# Altium schematic sheet SC945D_Interface_BP_et_Prog.SchDoc: Interface Boitier Principal & Programmation
size 393 x 270 mm; CompanyName: Seccom; Address1: 521, rue du capt. François Garbit; Address2: 69440 Mornant; Address3: seccom@seccom.fr; Address4: www.seccom.fr; DocumentNumber: 2; SheetNumber: 2; SheetTotal: 9; PageSetup: Record=PageOptions|CenterHorizontal=True|CenterVertical=True|PrintScale=0.74|XCorrection=1.00|YCorrection=1.00|PrintKind=0|BorderSize=5000000|LeftOffset=0|BottomOffset=0|Orientation=2|PaperLength=1000|PaperWidth=1000|Scale=100|PaperSource=7|PrintQuality=-4|MediaType=1|DitherType=10|PaperKind=A4|PrintScaleMode=1
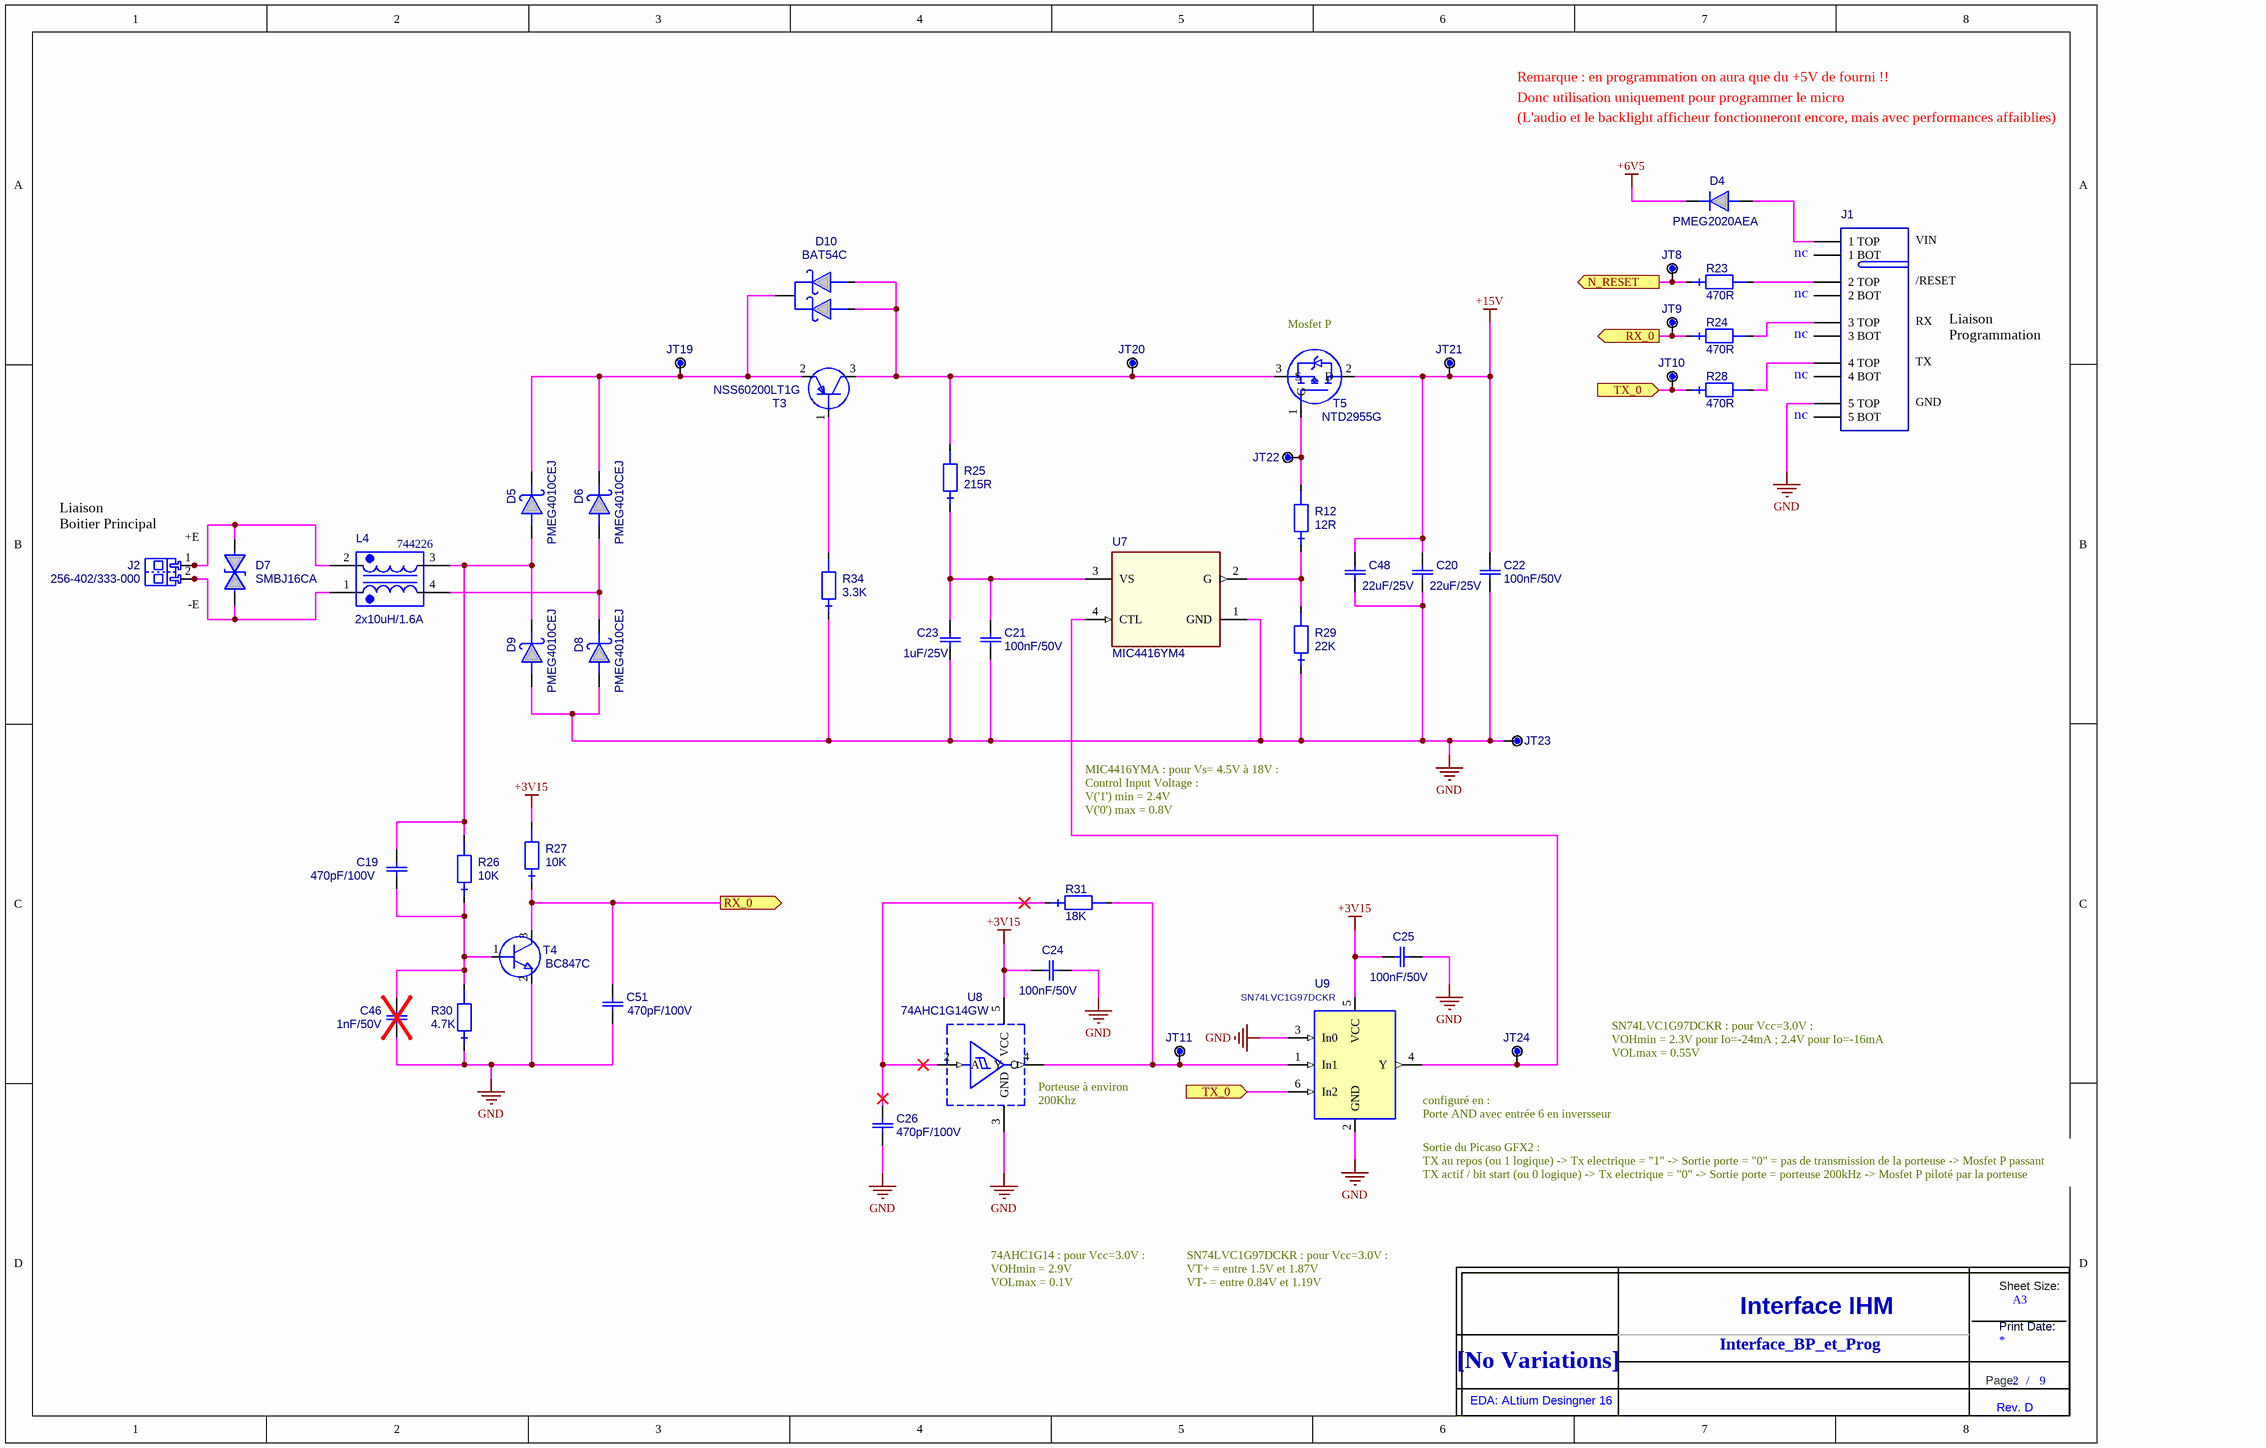
[diagram p0: SC945D_Interface_BP_et_Prog.SchDoc]

## Parts
C19  value 470pF/100V  [0805_ReflowSoldering_CAP]  (hidden comment: C_0805_NPO_5%_470P-100V)
C20  value 22uF/25V  [1206_ReflowSoldering_CAP]  (hidden comment: C_1206_X5R_20%_22U-25V)
C21  value 100nF/50V  [0603_ReflowSoldering_CAP]  (hidden comment: C_0603_X7R_10%_100N-50V)
C22  value 100nF/50V  [0603_ReflowSoldering_CAP]  (hidden comment: C_0603_X7R_10%_100N-50V)
C23  value 1uF/25V  [0805_ReflowSoldering_CAP]  (hidden comment: C_0805_X5R_10%_1U-25V)
C24  value 100nF/50V  [0603_ReflowSoldering_CAP]  (hidden comment: C_0603_X7R_10%_100N-50V)
C25  value 100nF/50V  [0603_ReflowSoldering_CAP]  (hidden comment: C_0603_X7R_10%_100N-50V)
C26  value 470pF/100V  [0805_ReflowSoldering_CAP]  (hidden comment: C_0805_NPO_5%_470P-100V)
C46  value 1nF/50V  [0603_ReflowSoldering_CAP]  (hidden comment: C_0603_NPO_5%_1N-50V)  (no BOM)
C48  value 22uF/25V  [1206_ReflowSoldering_CAP]  (hidden comment: C_1206_X5R_20%_22U-25V)
C51  value 470pF/100V  [0805_ReflowSoldering_CAP]  (hidden comment: C_0805_NPO_5%_470P-100V)
D4  PMEG2020AEA  [SOD323_ReflowSoldering]
D5  PMEG4010CEJ  [SOD323_ReflowSoldering]
D6  PMEG4010CEJ  [SOD323_ReflowSoldering]
D7  SMBJ16CA  [DO214AA-SMB-NP_ReflowSoldering]
D8  PMEG4010CEJ  [SOD323_ReflowSoldering]
D9  PMEG4010CEJ  [SOD323_ReflowSoldering]
D10  BAT54C  [SOT23_3L_ReflowSoldering]
J1  EMB_ZEC_1893711_HOTE  [EMB_ZEC_1893711_HOTE_NOBOTT]  (value not drawn)  (no BOM)
J2  value 256-402/333-000  [BVIS_02_WAGO_256-402/333-000]  (hidden comment: BLEV_CI_45D_5.08_02_256-402/333-000)
JT8  POINT_TEST_PAD_40MIL  [PAD_CMS_40X40_E]  (value not drawn)  (no BOM)
JT9  POINT_TEST_PAD_40MIL  [PAD_CMS_40X40_E]  (value not drawn)  (no BOM)
JT10  POINT_TEST_PAD_40MIL  [PAD_CMS_40X40_E]  (value not drawn)  (no BOM)
JT11  POINT_TEST_PAD_40MIL  [PAD_CMS_40X40_E]  (value not drawn)  (no BOM)
JT19  POINT_TEST_PAD_40MIL  [PAD_CMS_40X40_E]  (value not drawn)  (no BOM)
JT20  POINT_TEST_PAD_40MIL  [PAD_CMS_40X40_E]  (value not drawn)  (no BOM)
JT21  POINT_TEST_PAD_40MIL  [PAD_CMS_40X40_E]  (value not drawn)  (no BOM)
JT22  POINT_TEST_PAD_40MIL  [PAD_CMS_40X40_E]  (value not drawn)  (no BOM)
JT23  POINT_TEST_PAD_40MIL  [PAD_CMS_40X40_E]  (value not drawn)  (no BOM)
JT24  POINT_TEST_PAD_40MIL  [PAD_CMS_40X40_E]  (value not drawn)  (no BOM)
L4  value 2x10uH/1.6A  Ref Fab: 744226  [SELF_WE-SL2_9.2x6]  (hidden comment: IND_FERRITE_WE-SL2_2X10UH)
R12  value 12R  [0603_ReflowSoldering_RES]  (hidden comment: RES_0603_1%_100PPM_12R)
R23  value 470R  [0603_ReflowSoldering_RES]  (hidden comment: RES_0603_1%_100PPM_470R)
R24  value 470R  [0603_ReflowSoldering_RES]  (hidden comment: RES_0603_1%_100PPM_470R)
R25  value 215R  [0603_ReflowSoldering_RES]  (hidden comment: RES_0603_1%_100PPM_215R)
R26  value 10K  [0603_ReflowSoldering_RES]  (hidden comment: RES_0603_1%_100PPM_10K)
R27  value 10K  [0603_ReflowSoldering_RES]  (hidden comment: RES_0603_1%_100PPM_10K)
R28  value 470R  [0603_ReflowSoldering_RES]  (hidden comment: RES_0603_1%_100PPM_470R)
R29  value 22K  [0603_ReflowSoldering_RES]  (hidden comment: RES_0603_1%_100PPM_22K)
R30  value 4.7K  [0603_ReflowSoldering_RES]  (hidden comment: RES_0603_1%_100PPM_4.7K)
R31  value 18K  [0603_ReflowSoldering_RES]  (hidden comment: RES_0603_1%_100PPM_18K)
R34  value 3.3K  [0603_ReflowSoldering_RES]  (hidden comment: RES_0603_1%_100PPM_3.3K)
T3  NSS60200LT1G  [SOT23_3L_ReflowSoldering]
T4  BC847C  [SOT23_3L_ReflowSoldering]
T5  NTD2955G  [DPAK]
Title_new?  DNI  (value not drawn)  (graphical)
U7  MIC4416YM4  [SOT143]
U8  74AHC1G14GW  [SOT353]
U9  value SN74LVC1G97DCKR  [SC70_6]  (hidden comment: 74LVC1G97DCKR)

## Ports
N_RESET (out), RX_0 (out), TX_0 (in)

## Nets
+3V15: C24.2 C25.2 R27.2 U8.5(VCC) U9.5(VCC)
+6V5: D4.K
+15V: C20.2 C22.2 C48.2 JT21.1 T5.2(D)
GND: C20.1 C21.1 C22.1 C23.1 C24.1 C25.1 C26.1 C46.1 C48.1 C51.1 D8.A D9.A J1.5(5_TOP) JT23.1 R29.1 R30.1 R34.1 T4.2(E) U7.1(GND) U8.3(GND) U9.2(GND) U9.3(In0)
N_RESET: JT8.1 R23.1 ; port N_RESET
RX_0: C51.2 JT9.1 R24.1 R27.1 T4.3(C) ; port RX_0
TX_0: JT10.1 R28.1 U9.6(In2) ; port TX_0
NetC19_1: C19.1 C46.2 R26.1 R30.2 T4.1(B)
NetC19_2: C19.2 D5.A D9.K L4.3 R26.2
NetC21_2: C21.2 C23.2 R25.1 U7.3(VS)
NetC26_2: C26.2 R31.1 U8.2(A)
NetD4_A: D4.A J1.1(1_TOP)
NetD5_K: D5.K D6.K D10.3 JT19.1 T3.2(E)
NetD6_A: D6.A D8.K L4.4
NetD7_1: D7.1 J2.2 J2.4 L4.1
NetD7_2: D7.2 J2.1 J2.3 L4.2
NetD10_1: D10.1 D10.2 JT20.1 R25.2 T3.3(C) T5.3(S)
NetJ1_2: J1.2(2_TOP) R23.2
NetJ1_3: J1.3(3_TOP) R24.2
NetJ1_4: J1.4(4_TOP) R28.2
NetJT11_1: JT11.1 R31.2 U8.4(Y) U9.1(In1)
NetJT22_1: JT22.1 R12.2 T5.1(G)
NetJT24_1: JT24.1 U7.4(CTL) U9.4(Y)
NetR12_1: R12.1 R29.2 U7.2(G)
NetR34_2: R34.2 T3.1(B)

Not connected (* = marked no-connect by the designer): J1 6(1_BOT) 7(2_BOT) 8(3_BOT) 9(4_BOT) 10(5_BOT); U8 1

## Notes on the sheet
- Remarque : en programmation on aura que du +5V de fourni !!
- Donc utilisation uniquement pour programmer le micro
- (L'audio et le backlight afficheur fonctionneront encore, mais avec performances affaiblies)
- (near J1) nc
- VIN
- /RESET
- (near T5) Mosfet P
- RX
- TX
- Liaison Programmation
- GND
- (near J2) Liaison
  Boitier Principal
- +E
- -E
- MIC4416YMA : pour Vs= 4.5V à 18V :
  Control Input Voltage :
  V('1') min = 2.4V
  V('0') max = 0.8V
- SN74LVC1G97DCKR : pour Vcc=3.0V :
  VOHmin = 2.3V pour Io=-24mA ; 2.4V pour Io=-16mA
  VOLmax = 0.55V
- (near U8) Porteuse à environ 200Khz
- configuré en :
  Porte AND avec entrée 6 en inversseur
- (near U9) Sortie du Picaso GFX2 :
  TX au repos (ou 1 logique) -> Tx electrique = "1" -> Sortie porte = "0" = pas de transmission de la porteuse -> Mosfet P passant
  TX actif / bit start (ou 0 logique) -> Tx electrique = "0" -> Sortie porte = porteuse 200kHz -> Mosfet P piloté par la porteuse
- 74AHC1G14 : pour Vcc=3.0V :
  VOHmin = 2.9V
  VOLmax = 0.1V
- SN74LVC1G97DCKR : pour Vcc=3.0V :
  VT+ = entre 1.5V et 1.87V
  VT- = entre 0.84V et 1.19V
- Interface_BP_et_Prog
- (in symbol Title_new) Sheet Size:; A3; Interface IHM; Print Date:; [No Variations]; Page:; /; EDA: ALtium Desingner 16; Rev. D

## Library data of the parts
C19 C26 C51 = C_0805_NPO_5%_470P-100V: Condensateur céramique, NPO, 5%, CMS 0805; Creation: EC (30/04/10); Verification: LJ (20/05/10); Reference: 001384/00; Boitier: 0805; Remarque: {Remarque}; Coeff: 1; Fabricant: AVX; Ref Fab: 08051A471JAT2A; ComponentLink1URL: o:\_Documentation\Datasheets\BC_Components\Condo_CMS_NPO-X7R-Y5V.pdf; ComponentLink2URL: o:\_Documentation\Datasheets\_BOITIERS\PASSIF_CMS\RC_0805_(2x1,25)_(Schneider).PDF; Config: *; ComponentLink1Description: Datasheet; ComponentLink2Description: Datasheet Boitier; Supplier 1: Farnell; Supplier 2: Mouser; Supplier Part Number 1: 499195; Supplier Part Number 2: 581-08051A471J
C20 C48 = C_1206_X5R_20%_22U-25V: Condensateur céramique, X5R, 20%, CMS 1206, 22uF/25V; Creation: ZA (18/12/13); Reference: /01; Boitier: 1206; Remarque: {Remarque}; Coeff: 1; Fabricant: TDK; Ref Fab: C3216X5R1E226M160AB; Verification: *; ComponentLink1URL: O:\_Documentation\Datasheets\TDK\general_B11.pdf; ComponentLink2URL: o:\_Documentation\Datasheets\_BOITIERS\PASSIF_CMS\; ComponentLink1Description: Datasheet; ComponentLink2Description: Datasheet Boitier; Supplier 1: Farnell; Supplier Part Number 1: 2354129; Supplier 2: Mouser; Supplier Part Number 2: 810-C3216X5R1E226M
C21 C22 C24 C25 = C_0603_X7R_10%_100N-50V: Condensateur céramique, X7R, 10%, CMS 0603, 100nF/50V; Creation: FB (29/02/12); Boitier: 0603; Remarque: {Remarque}; Fabricant: Kemet; Ref Fab: C0603C104K5RAC; Coeff: 1; ComponentLink1URL: O:\_Documentation\Datasheets\Kemet\Condos_Ceramic_CMS.pdf; ComponentLink2URL: o:\_Documentation\Datasheets\_BOITIERS\PASSIF_CMS\; Config: *; ComponentLink1Description: Datasheet; ComponentLink2Description: Datasheet Boitier; Supplier 1: Farnell; Supplier Part Number 1: 1288255
C23 = C_0805_X5R_10%_1U-25V: Condensateur céramique, X5R, 10%, CMS 0805; Creation: FB (07/03/12); Reference: 001834/00; Boitier: 0805; Remarque: {Remarque}; Coeff: 1; Fabricant: AVX; Ref Fab: 08053D105KAT2A; Verification: *; ComponentLink1URL: O:\_Documentation\Datasheets\AVX\Condensateurs_CMS_Ceramic_X5R.pdf; ComponentLink2URL: o:\_Documentation\Datasheets\_Boitiers\PASSIF_CMS\RC_0805_(2x1,25)_(Schneider).pdf; Config: *; ComponentLink1Description: Datasheet; ComponentLink2Description: Datasheet Boitier; Supplier Part Number 1: 1327695; Supplier Part Number 2: 6983409; Supplier 1: Farnell; Supplier 2: Radiospares
C46 = C_0603_NPO_5%_1N-50V: Condensateur céramique, NPO, 5%, CMS 0603; Creation: LJ; Reference: 001809/00; Boitier: 0603; Remarque: {Remarque}; Coeff: 1; Fabricant: AVX; Ref Fab: 06035A102JAT2A; ComponentLink1URL: o:\_Documentation\Datasheets\BC_Components\Condo_CMS_NPO-X7R-Y5V.pdf; ComponentLink2URL: o:\_Documentation\Datasheets\_BOITIERS\PASSIF_CMS\; Config: *; ComponentLink1Description: Datasheet; ComponentLink2Description: Datasheet Boitier; Supplier 1: Mouser; Supplier Part Number 1: 581-06035A102J
D4 = PMEG2020AEA: Diode Schottky, Vrrm=20V, If=2A, Vf=0.45V, CMS; Creation: PDP (10/07/12); Boitier: SOD323; Remarque: {Remarque}; Coeff: 1; Fabricant: NXP; Verification: *; ComponentLink1URL: o:\_Documentation\Datasheets\NXP\PMEG2020AEA.PDF; ComponentLink2URL: o:\_Documentation\Datasheets\_BOITIERS\ACTIF_CMS\SOD\SOD_80_(MLL34)_(Schneider).PDF; Config: *; ComponentLink1Description: Datasheet; ComponentLink2Description: Datasheet Boitier; Ref Fab: PMEG2020AEA; Value: PMEG2020AEA
D5 D6 D8 D9 = PMEG4010CEJ: Diode Schottky, Vrrm=40V, If=1A, Vf=0.49V, CMS, -65/+150°C; Creation: FB (30/07/13); Boitier: SOD323F; Remarque: {Remarque}; Coeff: 1; Fabricant: NXP; Verification: *; ComponentLink1URL: O:\_Documentation\Datasheets\NXP\PMEG4010CEH_PMEG4010CEJ.pdf; Config: *; ComponentLink1Description: Datasheet; ComponentLink2Description: Datasheet Boitier; Ref Fab: PMEG4010CEJ; Value: PMEG4010CEJ; Supplier 1: Farnell; Supplier Part Number 1: 1757777; Supplier 2: Mouser; Supplier Part Number 2: 771-PMEG4010CEJ-T/R
D7 = SMBJ16CA: Diode Transil/TVS bidirectionnelle (CA), 600W, 16V, CMS, serie SMBJ; Creation: FB (30/07/13); Boitier: DO214AA/SMB; Remarque: {Remarque}; Coeff: 1; Fabricant: Bourns; ComponentLink1URL: O:\_Documentation\Datasheets\Bourns\SMBJ_diodes_TVS_600W.pdf; ComponentLink2URL: o:\_Documentation\Datasheets\_BOITIERS\ACTIF_CMS\SMx\SMB_(Schneider).lnk; Config: *; ComponentLink1Description: Datasheet; ComponentLink2Description: Datasheet Boitier; Ref Fab: SMBJ16CA; Supplier Part Number 1: 652-SMBJ16CA; Supplier 1: Mouser; Value: SMBJ16CA
D10 = BAT54C: Diode Schottky double, BAT54 cathode com, Vrrm=30V, If=300mA, Vf=0.4Vmax, CMS; Creation: LJ (14/05/02); Reference: 000597/00; Boitier: SOT23_3L; Remarque: {Remarque}; Coeff: 1; Fabricant: NXP; Verification: LJ (14/05/02); ComponentLink1URL: O:\_Documentation\Datasheets\NXP\BAT54_series.pdf; ComponentLink2URL: o:\_Documentation\Datasheets\_BOITIERS\ACTIF_CMS\SOT\SOT_23_3P_(Schneider).PDF; Config: *; ComponentLink1Description: Datasheet; ComponentLink2Description: Datasheet Boitier; Ref Fab: BAT54C; Supplier 1: Farnell; Supplier Part Number 1: 1081192; Value: BAT54C
J1 = EMB_ZEC_1893711_HOTE: Implantation CI pour connecteur ZEC 1,0/5-ST-3,5 C1 R1,5 (ref 1893711); Creation: JPL (18/07/12); Fabricant: Phoenix Contact; Coeff: 1; Config: *; ComponentLink1Description: Datasheet; ComponentLink2Description: Datasheet Boitier
J2 = BLEV_CI_45D_5.08_02_256-402/333-000: Bornier à levier pour CI, e5.08, 2pts, 45 degrés, 300V/15A, AWG 28-12, Gris; Creation: LJ; Remarque: {Remarque}; Fabricant: Wago; Coeff: 1; Ref Fab: 256-402/333-000; Config: *; ComponentLink1Description: Datasheet; ComponentLink2Description: Datasheet; Supplier 1: Farnell; Supplier Part Number 1: 1695013
JT8-JT11 JT19-JT24 = POINT_TEST_PAD_40MIL: Point de test sur CI, pad de diamètre 1.016mm (40mils); Creation: FB (04/10/12); Remarque: {Remarque}; Coeff: 1; Value: POINT_TEST; Config: *; ComponentLink1Description: Datasheet; ComponentLink2Description: Datasheet Boitier
L4 = IND_FERRITE_WE-SL2_2X10UH: Filtre double ferrite, 2x10uH, 42Vac/80Vdc, 1.6A, serie WE-SL2, -40/+125°C, CMS; Creation: FB (19/03/12); Boitier: WE-SL2_9.2x6_h5mm; Coeff: 1; Fabricant: Wurth Elektronik; ComponentLink1URL: O:\_Documentation\Datasheets\Wurth_Elektronik\744226.pdf; ComponentLink2URL: o:\_Documentation\Datasheets\_BOITIERS\; Config: *; ComponentLink1Description: Datasheet; ComponentLink2Description: Datasheet Boitier; Supplier Part Number 1: 1636269; Supplier 1: Farnell; Supplier 2: Radiospares; Supplier Part Number 2: 3675045
R12 = RES_0603_1%_100PPM_12R: Résistance, 0.100W, 1%, 100ppm, 75V, 12R; Creation: FB (11/09/12); Boitier: 0603; Remarque: {Remarque}; Fabricant: Vishay; Ref Fab: CRCW060312R0FKEA; Coeff: 1; Verification: *; ComponentLink1URL: O:\_Documentation\Datasheets\Vishay\Resistances_D-CRCWe3.pdf; ComponentLink2URL: o:\_Documentation\Datasheets\_BOITIERS\PASSIF_CMS\; Config: *; ComponentLink1Description: Datasheet; ComponentLink2Description: Datasheet Boitier; Supplier 1: Farnell; Supplier Part Number 1: 1652838; Supplier 2: Mouser; Supplier Part Number 2: 71-CRCW0603-12-E3
R23 R24 R28 = RES_0603_1%_100PPM_470R: Résistance, 0.100W, 1%, 100ppm, 75V, 470R; Creation: FB (29/07/13); Boitier: 0603; Remarque: {Remarque}; Fabricant: Vishay; Ref Fab: CRCW0603470RFKEA; Coeff: 1; Verification: *; ComponentLink1URL: O:\_Documentation\Datasheets\Vishay\Resistances_D-CRCWe3.pdf; ComponentLink2URL: o:\_Documentation\Datasheets\_BOITIERS\PASSIF_CMS\; Config: *; ComponentLink1Description: Datasheet; ComponentLink2Description: Datasheet Boitier; Supplier 1: Farnell; Supplier Part Number 1: 1469815; Supplier 2: Mouser; Supplier Part Number 2: 71-CRCW0603-470-E3
R25 = RES_0603_1%_100PPM_215R: Résistance, 0.100W, 1%, 100ppm, 75V, 215R; Creation: FB (05/03/12); Boitier: 0603; Remarque: {Remarque}; Fabricant: Vishay; Ref Fab: CRCW0603215RFKEA; Coeff: 1; Verification: *; ComponentLink1URL: O:\_Documentation\Datasheets\Vishay\Resistances_D-CRCWe3.pdf; ComponentLink2URL: o:\_Documentation\Datasheets\_BOITIERS\PASSIF_CMS\; Config: *; ComponentLink1Description: Datasheet; ComponentLink2Description: Datasheet Boitier; Supplier 1: Farnell; Supplier 2: RadioSpares; Supplier Part Number 1: 1252503; Supplier Part Number 2: 6789976
R26 R27 = RES_0603_1%_100PPM_10K: Résistance, 0.100W, 1%, 100ppm, 75V, 10K; Creation: JPL (05/07/12); Boitier: 0603; Remarque: {Remarque}; Fabricant: Vishay; Ref Fab: CRCW060310K0FKEA; Coeff: 1; Verification: *; ComponentLink1URL: O:\_Documentation\Datasheets\Vishay\Resistances_D-CRCWe3.pdf; ComponentLink2URL: o:\_Documentation\Datasheets\_BOITIERS\PASSIF_CMS\; Config: *; ComponentLink1Description: Datasheet; ComponentLink2Description: Datasheet Boitier; Supplier 1: Farnell; Supplier 2: RadioSpares; Supplier Part Number 1: 1469748; Supplier Part Number 2: 6789667
R29 = RES_0603_1%_100PPM_22K: Résistance, 0.100W, 1%, 100ppm, 75V, 22K; Creation: JPL (05/07/12); Boitier: 0603; Remarque: {Remarque}; Fabricant: Vishay; Ref Fab: CRCW060322K0FKEA; Coeff: 1; Verification: *; ComponentLink1URL: O:\_Documentation\Datasheets\Vishay\Resistances_D-CRCWe3.pdf; ComponentLink2URL: o:\_Documentation\Datasheets\_BOITIERS\PASSIF_CMS\; Config: *; ComponentLink1Description: Datasheet; ComponentLink2Description: Datasheet Boitier; Supplier 1: Farnell; Supplier 2: RadioSpares; Supplier Part Number 1: 1469779; Supplier Part Number 2: 6790005
R30 = RES_0603_1%_100PPM_4.7K: Résistance, 0.100W, 1%, 100ppm, 75V, 4.7K; Creation: JPL (05/07/12); Boitier: 0603; Remarque: {Remarque}; Fabricant: Vishay; Ref Fab: CRCW06034K70FKEA; Coeff: 1; Verification: *; ComponentLink1URL: O:\_Documentation\Datasheets\Vishay\Resistances_D-CRCWe3.pdf; ComponentLink2URL: o:\_Documentation\Datasheets\_BOITIERS\PASSIF_CMS\; Config: *; ComponentLink1Description: Datasheet; ComponentLink2Description: Datasheet Boitier; Supplier 1: Farnell; Supplier 2: RadioSpares; Supplier Part Number 1: 1469807; Supplier Part Number 2: 6790484
R31 = RES_0603_1%_100PPM_18K: Résistance, 0.100W, 1%, 100ppm, 75V, 18K; Creation: JPL (05/07/12); Boitier: 0603; Remarque: {Remarque}; Fabricant: Vishay; Ref Fab: CRCW060318K0FKEA; Coeff: 1; Verification: *; ComponentLink1URL: O:\_Documentation\Datasheets\Vishay\Resistances_D-CRCWe3.pdf; ComponentLink2URL: o:\_Documentation\Datasheets\_BOITIERS\PASSIF_CMS\; Config: *; ComponentLink1Description: Datasheet; ComponentLink2Description: Datasheet Boitier; Supplier 1: Farnell; Supplier 2: RadioSpares; Supplier Part Number 1: 1692519; Supplier Part Number 2: 6789857
R34 = RES_0603_1%_100PPM_3.3K: Résistance, 0.100W, 1%, 100ppm, 75V, 3.3K; Creation: PDP (19/09/12); Boitier: 0603; Remarque: {Remarque}; Fabricant: Vishay; Ref Fab: CRCW06033K30FKEA; Coeff: 1; Verification: *; ComponentLink1URL: O:\_Documentation\Datasheets\Vishay\Resistances_D-CRCWe3.pdf; ComponentLink2URL: o:\_Documentation\Datasheets\_BOITIERS\PASSIF_CMS\; Config: *; ComponentLink1Description: Datasheet; ComponentLink2Description: Datasheet Boitier; Supplier 1: Mouser; Supplier Part Number 1: 71-CRCW0603-3.3K-E3
T3 = NSS60200LT1G: Transistor PNP, Vce=-60V, Ic=-4A, Rdson 0.080r, -55 à 150°C, CMS; Creation: ZA (18/12/13); Reference: /01; Boitier: SOT23_3L; Remarque: {Remarque}; Coeff: 1; Fabricant: ON Semi; Verification: *; ComponentLink1URL: o:\_Documentation\Datasheets\ON_Semiconductors\NSS60200L-D.PDF; ComponentLink2URL: o:\_Documentation\Datasheets\ON_Semiconductors\NSS60200L-D.PDF; Config: *; ComponentLink1Description: Datasheet; Ref Fab: NSS60200LT1G; ComponentLink2Description: Datasheet Boitier; Supplier 1: Farnell; Supplier Part Number 1: 2317570; Supplier 2: Mouser; Supplier Part Number 2: 863-NSS60200LT1G; Value: NSS60200LT1G
T4 = BC847C: Transistor NPN, Vce=50V, Ic=0.1A, hfe=420~800, 0.25W, CMS; Creation: GO (08/07/05); Verification: LJ (21/07/05); Reference: 000329/00; Boitier: SOT23_3L; Remarque: Complementaires aux BC856-860; Coeff: 1; Fabricant: NXP; ComponentLink1URL: O:\_Documentation\Datasheets\NXP\BC847.pdf; ComponentLink2URL: o:\_Documentation\Datasheets\_BOITIERS\ACTIF_CMS\SOT\SOT_23_3P_(Schneider).PDF; Config: *; ComponentLink1Description: Datasheet; Value: BC847C; Supplier 1: Farnell; Supplier Part Number 1: 1081235; Ref Fab: BC847C; ComponentLink2Description: Datasheet Boitier
T5 = NTD2955G: Transistor Mosfet P, Vdss=60V, Id=12A, Rdson=0.155R, -55/+175°C, CMS; Creation: PDP (13/07/12); Coeff: 1; Fabricant: ON Semiconductor; Boitier: DPAK; Verification: *; ComponentLink1URL: O:\_Documentation\Datasheets\ON_Semiconductors\NTD2955.PDF; ComponentLink2URL: o:\_Documentation\Datasheets\_BOITIERS\ACTIF_CMS\; Config: *; ComponentLink1Description: Datasheet; Ref Fab: NTD2955G; Supplier 1: Farnell; Supplier Part Number 1: 2101431; Supplier 2: Mouser; Supplier Part Number 2: 863-NTD2955G; ComponentLink2Description: Datasheet Boitier; Value: NTD2955G
Title_new? = Title_new
U7 = MIC4416YM4: Low side MOSFET Driver ,+4.5V to +18V,1.2A peak, non-inverting, -40/+85°C, CMS; Creation: CHD (21/02/12); Verification: FB (11/09/12); Fabricant: Micrel; Coeff: 1; Boitier: SOT143; Ref Fab: MIC4416YM4; ComponentLink1URL: O:\_Documentation\Datasheets\Micrel\MIC4416_4417.pdf; Config: *; ComponentLink1Description: Datasheet; ComponentLink2Description: Datasheet Boitier; Supplier 1: Farnell; Supplier Part Number 1: 1100664; Value: MIC4416YM4
U8 = 74AHC1G14GW: Inverseur simple, Trigger de Schmitt, AHC, Picogate, CMS; Creation: LJ (25/06/09); Reference: 000742/00; Remarque: {Remarque}; Coeff: 1; Fabricant: NXP; Verification: *; Boitier: SOT353; ComponentLink1URL: o:\_Documentation\Datasheets\NXP\74AHC1G14-74AHCT1G14.pdf; ComponentLink2URL: o:\_Documentation\Datasheets\_BOITIERS\ACTIF_CMS\SOT\SOT_23_5P_(Schneider).pdf; Config: *; ComponentLink1Description: Datasheet; ComponentLink2Description: Datasheet Boitier; Supplier 1: Farnell; Supplier Part Number 1: 1085241; Value: 74AHC1G14GW; Ref Fab: 74AHC1G14GW
U9 = 74LVC1G97DCKR: Porte logique multifonction, AND/OR/NAND/NOR/INV/BUFFER, LVC, CMS SC70_6; Creation: LJ (01/08/08); Reference: 000193/00; Remarque: {Remarque}; Coeff: 1; Fabricant: Texas Instruments; Verification: *; Boitier: SC70_6; ComponentLink1URL: o:\_Documentation\Datasheets\Texas\SN74LVC1G97.pdf; ComponentLink2URL: o:\_Documentation\Datasheets\_Boitiers\ACTIF_CMS\SC\SC70_6_e0,65_(NSC).pdf; Config: *; ComponentLink1Description: Datasheet; ComponentLink2Description: Datasheet Boitier; Ref Fab: SN74LVC1G97DCKR; Supplier 1: Farnell; Supplier 2: Mouser; Supplier Part Number 1: 1470839; Supplier Part Number 2: 595-SN74LVC1G97DCKR